# EAGLE design pinoccio-irrigation (EAGLE 6.2)
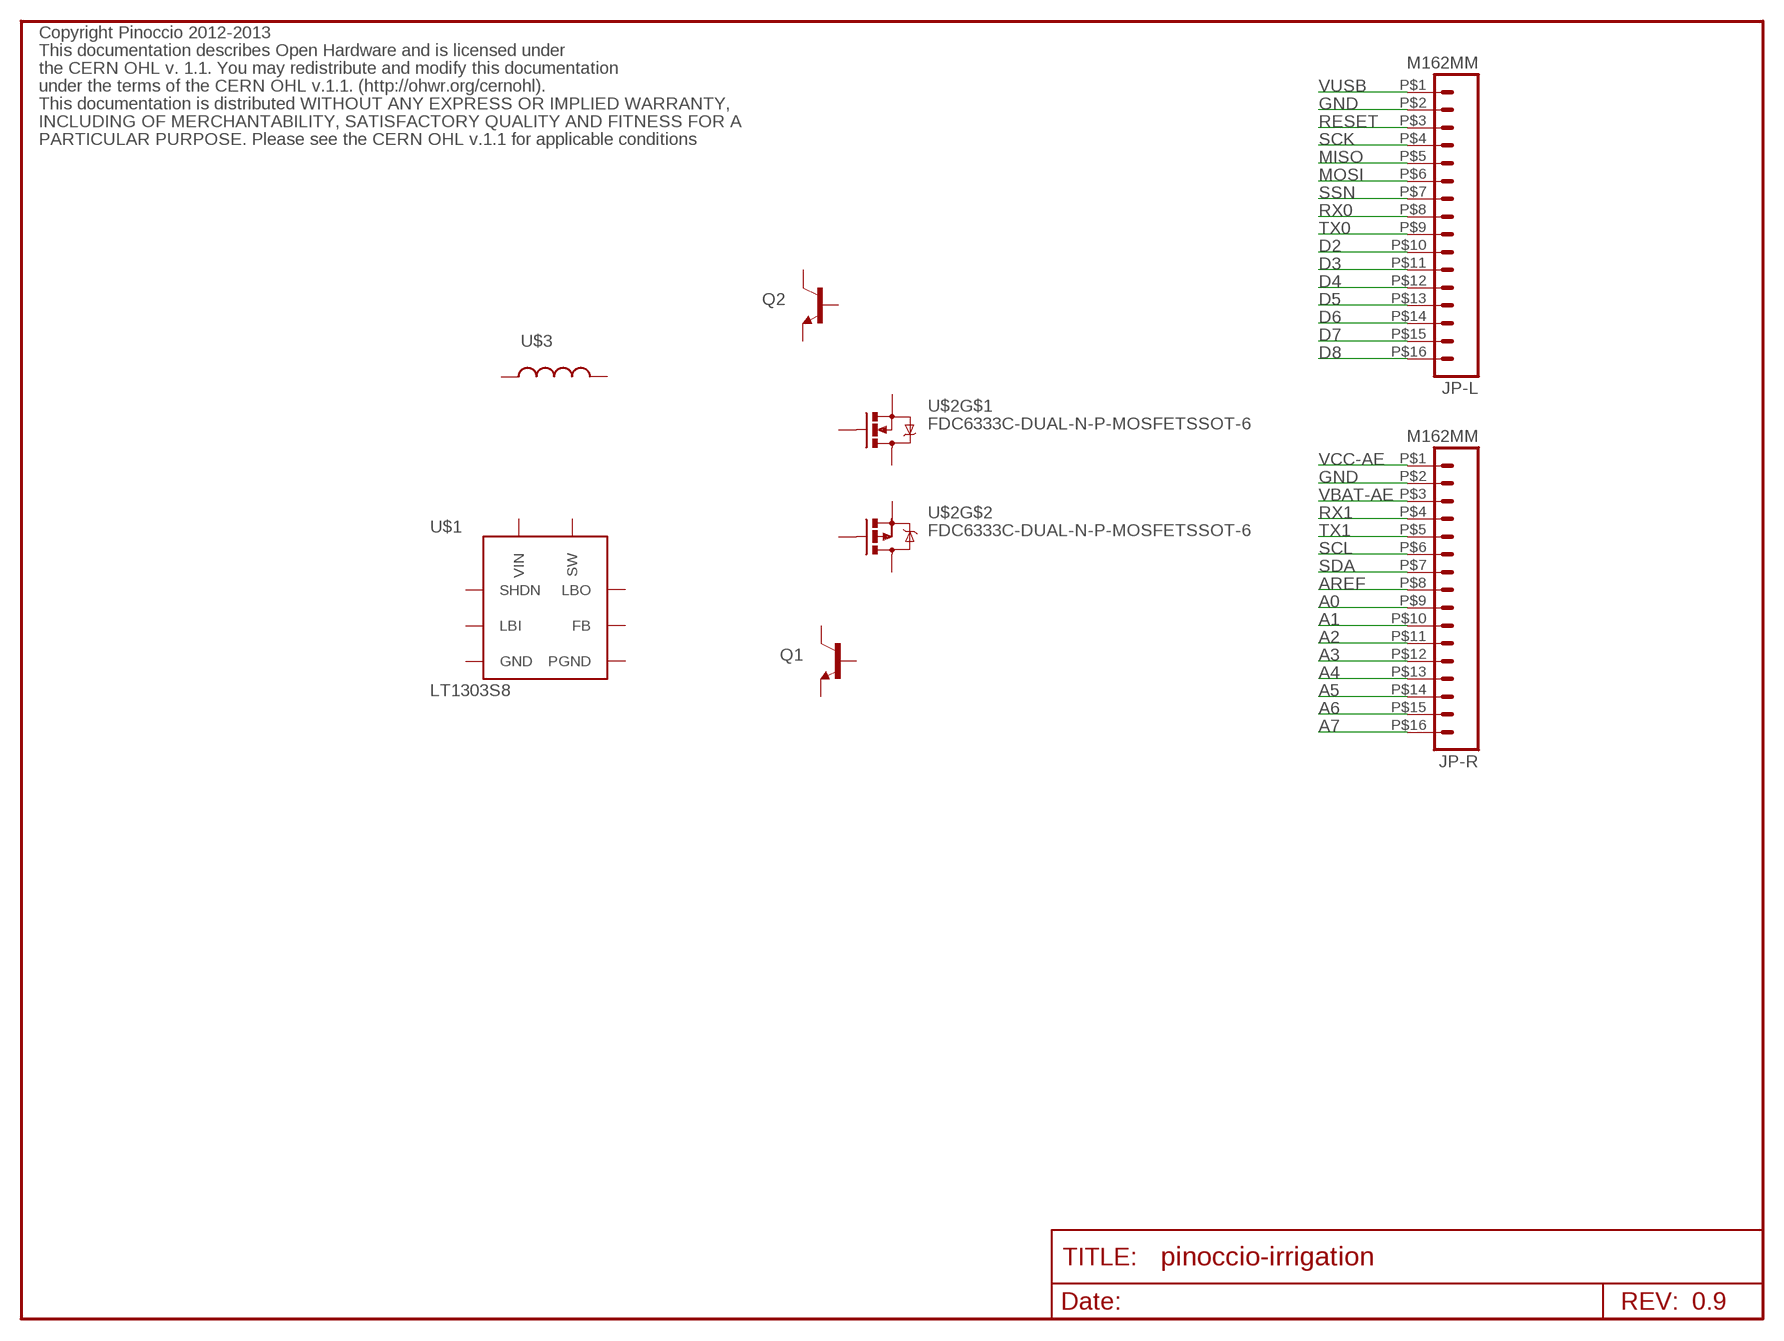
[diagram p0: schematic, sheet 1]

## Parts
JP-L  M162MM  [1X16_2MM]
JP-R  M162MM  [1X16_2MM]
Q1  TRANSISTOR-NPNSOT23-3  [SOT23-3]
Q2  TRANSISTOR-NPNSOT23-3  [SOT23-3]
U$1  LT1303S8  [S8]
U$2  FDC6333C-DUAL-N-P-MOSFETSSOT-6  [SSOT-6]
U$3  INDUCTORCC  [INDUCTOR-COILCRAFT]

## Nets
A0: JP-R.P$9
A1: JP-R.P$10
A2: JP-R.P$11
A3: JP-R.P$12
A4: JP-R.P$13
A5: JP-R.P$14
A6: JP-R.P$15
A7: JP-R.P$16
AREF: JP-R.P$8
D2: JP-L.P$10
D3: JP-L.P$11
D4: JP-L.P$12
D5: JP-L.P$13
D6: JP-L.P$14
D7: JP-L.P$15
D8: JP-L.P$16
GND [GND]: JP-L.P$2 JP-R.P$2
MISO: JP-L.P$5
MOSI: JP-L.P$6
RESET: JP-L.P$3
RX0: JP-L.P$8
RX1: JP-R.P$4
SCK: JP-L.P$4
SCL: JP-R.P$6
SDA: JP-R.P$7
SSN: JP-L.P$7
TX0: JP-L.P$9
TX1: JP-R.P$5
VBAT-AE: JP-R.P$3
VCC-AE: JP-R.P$1
VUSB: JP-L.P$1
Unconnected: Q1.1(B) Q1.2(E) Q1.3(C) Q2.1(B) Q2.2(E) Q2.3(C) U$1.P$1(GND) U$1.P$2(LBO) U$1.P$3(SHDN) U$1.P$4(FB) U$1.P$5(LBI) U$1.P$6(VIN) U$1.P$7(SW) U$1.P$8(PGND) U$2.P$1(G) U$2.P$2(S) U$2.P$3(G) U$2.P$4(D) U$2.P$5(S) U$2.P$6(D) U$3.P$1 U$3.P$2

## Notes on the sheet
- Copyright Pinoccio 2012-2013
- This documentation describes Open Hardware and is licensed under
- the CERN OHL v. 1.1. You may redistribute and modify this documentation
- under the terms of the CERN OHL v.1.1. (http://ohwr.org/cernohl).
- This documentation is distributed WITHOUT ANY EXPRESS OR IMPLIED WARRANTY,
- INCLUDING OF MERCHANTABILITY, SATISFACTORY QUALITY AND FITNESS FOR A
- PARTICULAR PURPOSE. Please see the CERN OHL v.1.1 for applicable conditions
- 0.9
- /Volumes/Data/Users/eric/Desktop/pinoccio.bmp
- /Volumes/Data/Users/eric/Desktop/pinoccio-1in.bmp | /Volumes/Data/Users/eric/Desktop/pinoccio-full-3-4in.bmp | /Volumes/Data/Users/eric/Desktop/pinoccio-full-3-4in.bmp

## Library data of the parts
JP-L JP-R = Pinoccio:M16
Q1 Q2 = Pinoccio:TRANSISTOR-NPN: Transistor NPN BJT configuration in SOT23 package. MMBT2222 is the common NPN we use. Double check BCE configuration again layout.
U$1 = Pinoccio:LT1303
U$2 = Pinoccio:FDC6333C-DUAL-N-P-MOSFET
U$3 = Pinoccio:INDUCTOR

## Net classes
0 Default: width 0.203 mm
1 VCC: width 0.305 mm
2 LEDPower: width 0.203 mm
3 ButtonSignal: width 0.203 mm
4 RF Antenna: width 0.305 mm
5 GND: width 0.203 mm

## Board
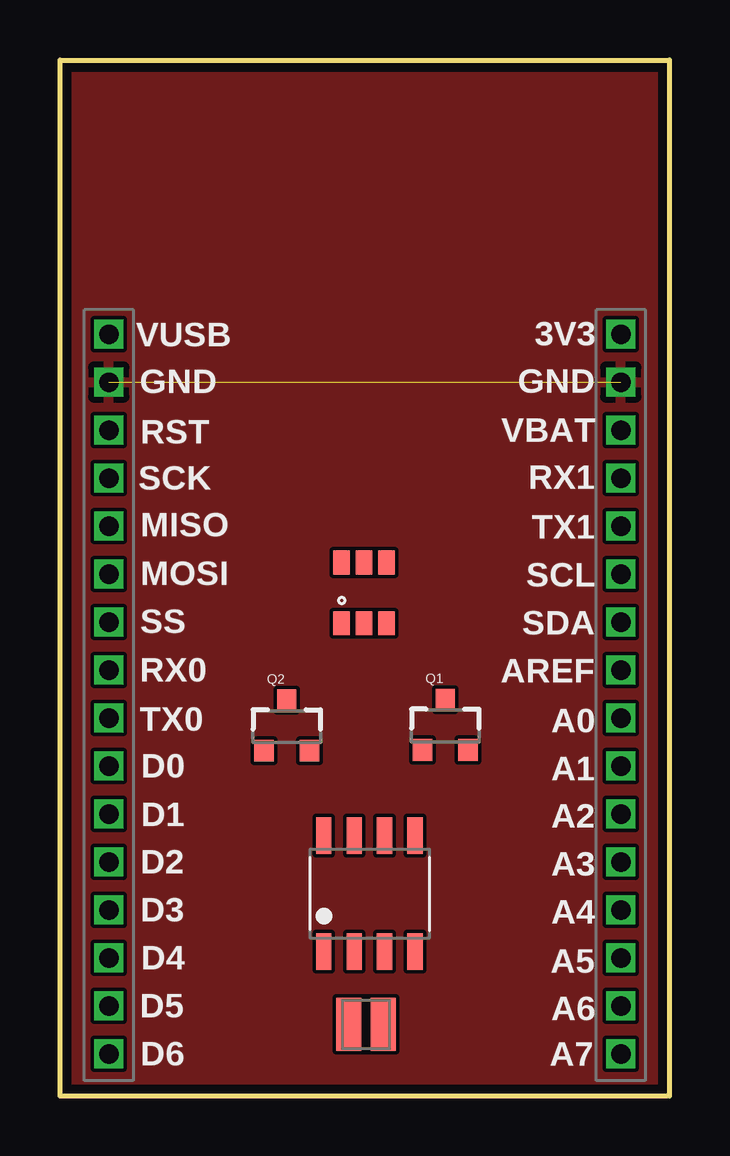
[diagram p1: board, top side]
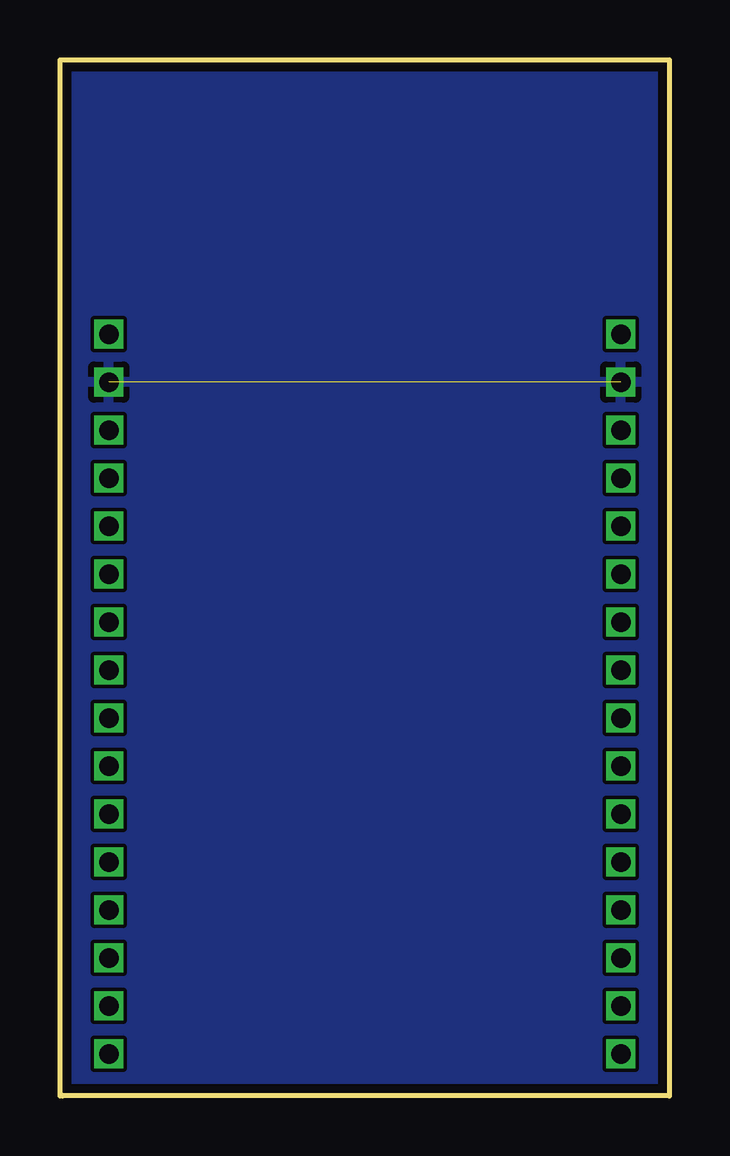
[diagram p2: board, bottom side, seen from below]

Size 25.4 x 43.18 mm. Coordinates in mm from the lower left corner, seen from the top.
Outline: 0,0 0,43.18 25.4,43.18 25.4,0
Outline: 0.03,0 25.3,0 25.32,0.02
Copper layers (1*16): Top 0.0356mm / dielectric 1.5011mm / Bottom 0.0356mm
Design rules: minimum track width 6mil, minimum drill 13mil, track to track 6mil, track to pad 6mil, pad to pad 6mil, via to via 6mil, smd to smd 6mil, copper to edge 15mil, drill to drill 6mil, minimum pad ring 7mil, minimum via ring 7mil, stop-mask expansion 4mil, vias tented up to drill 16mil, thermal gap 10mil

### Footprints (pad centres in the part's own frame; a part is rotated, then mirrored left to right if it is on the bottom)
1X16_2MM = drill 0.813 square: P$1 0,0; P$2 2,0; P$3 4,0; P$4 6,0; P$5 8,0; P$6 10,0; P$7 12,0; P$8 14,0; P$9 16,0; P$10 18,0; P$11 20,0; P$12 22,0; P$13 24,0; P$14 26,0; P$15 28,0; P$16 30,0
SOT23-3 = smd 0.8 x 0.9: 1 -0.95,-1; 2 0.95,-1; 3 0,1.1
S8 = smd 0.635 x 1.524: P$1 0.318,0.762; P$2 1.587,0.762; P$3 2.857,0.762; P$4 4.128,0.762; P$5 4.128,5.588; P$6 2.857,5.588; P$7 1.587,5.588; P$8 0.318,5.588
SSOT-6 = smd 0.686 x 0.991: P$1 0.343,0.495; P$2 1.283,0.495; P$3 2.223,0.495; P$4 2.223,3.035; P$5 1.283,3.035; P$6 0.343,3.035
INDUCTOR-COILCRAFT = smd 1.041 x 2.21: P$1 0.521,1.105; P$2 1.968,1.105

### Placement (x,y rotation side)
JP-L  2.03,31.75 270 top
JP-R  23.37,31.75 270 top
Q1  16.05,15.42 0 top
Q2  9.45,15.39 0 top
U$1  10.67,5.26 0 top
U$2  11.38,19.2 0 top
U$3  11.51,1.88 0 top

### Tracks (layer width: path | path; a pad name or v marks a point on that pad's centre or on a via)
GND  (1 unrouted)
  pour Top: 0.08,43.33 0.03,43.33 0.03,-0.03 25.37,-0.03 25.37,0 25.37,43.28 0.08,43.28
  pour Bottom: 0.08,43.15 0.03,43.15 0.03,0.03 24.89,0 25.07,0 25.37,-0.03 25.37,43.26 0.1,43.26

### Text on the board
tPlace: 3V3 | VUSB | GND | GND | VBAT | RST | RX1 | SCK | TX1 | MISO | SCL | MOSI | SDA | SS | AREF | RX0 | A0 | TX0 | A1 | D0 | A2 | D1 | A3 | D2 | A4 | D3 | A5 | D4 | A6 | D5 | A7 | D6
tDocu: Pinoccio(tm) Proto v0.9 | Design by: Eric Jennings for Pinoccio | http://pinocc.io | Licensed under CERN OHL v.1.1